# EAGLE design DigitalClockSegmentDisplay_Separator (EAGLE 9.6.1)
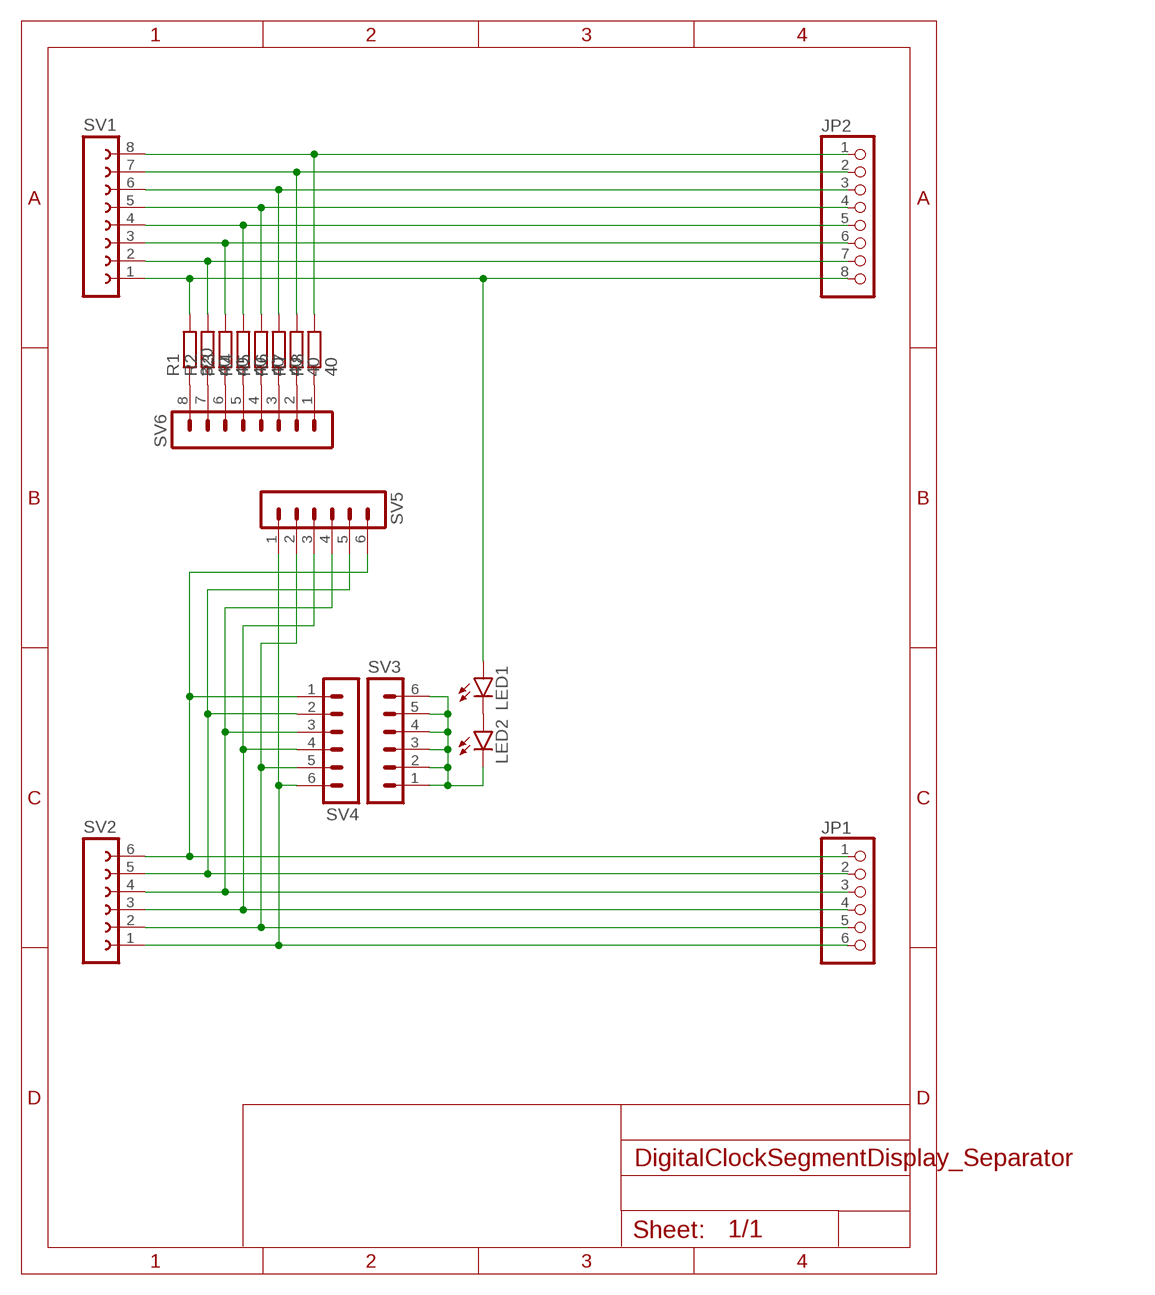
[diagram p0: schematic, sheet 1]

## Parts
JP1  PINHD-1X6/90  [1X06/90]
JP2  PINHD-1X8/90  [1X08/90]
LED1  LED5MM  [LED5MM]
LED2  LED5MM  [LED5MM]
R1  320  R-EU_0207/10  [0207/10]
R2  40  R-EU_0207/10  [0207/10]
R3  40  R-EU_0207/10  [0207/10]
R4  40  R-EU_0207/10  [0207/10]
R5  40  R-EU_0207/10  [0207/10]
R6  40  R-EU_0207/10  [0207/10]
R7  40  R-EU_0207/10  [0207/10]
R8  40  R-EU_0207/10  [0207/10]
SV1  FE08W  [FE08W]
SV2  FE06W  [FE06W]
SV3  MA06-1  [MA06-1]
SV4  MA06-1  [MA06-1]
SV5  MA06-1  [MA06-1]
SV6  MA08-1  [MA08-1]

## Nets
N$1: JP2.1 R8.2 SV1.8
N$2: JP2.2 R7.2 SV1.7
N$3: JP2.3 R6.2 SV1.6
N$4: JP2.4 R5.2 SV1.5
N$5: JP2.5 R4.2 SV1.4
N$6: JP2.6 R3.2 SV1.3
N$7: JP2.7 R2.2 SV1.2
N$8: JP2.8 LED1.A R1.2 SV1.1
N$9: JP1.1 SV2.6 SV4.1 SV5.6
N$10: JP1.2 SV2.5 SV4.2 SV5.5
N$11: JP1.3 SV2.4 SV4.3 SV5.4
N$12: JP1.4 SV2.3 SV4.4 SV5.3
N$13: JP1.5 SV2.2 SV4.5 SV5.2
N$14: JP1.6 SV2.1 SV4.6 SV5.1
N$15: LED2.K(C) SV3.1 SV3.2 SV3.3 SV3.4 SV3.5 SV3.6
N$16: LED1.K(C) LED2.A
N$17: R1.1 SV6.8
N$18: R2.1 SV6.7
N$19: R3.1 SV6.6
N$20: R4.1 SV6.5
N$21: R5.1 SV6.4
N$22: R6.1 SV6.3
N$23: R7.1 SV6.2
N$24: R8.1 SV6.1

## Library data of the parts
JP1 = pinhead:PINHD-1X6: PIN HEADER
JP2 = pinhead:PINHD-1X8: PIN HEADER
LED1 LED2 = led:LED: LED OSRAM: - CHIPLED LG R971, LG N971, LY N971, LG Q971, LY Q971, LO R971, LY R971 LH N974, LH R974 LS Q976, LO Q976, LY Q976 LO Q996 - Hyper CHIPLED LW Q18S LB Q993, LB Q99A, LB R99A - SideLED LS A670, LO A670, LY A670, LG A670, LP A670 LB A673, LV A673, LT A673, LW A673 LH A674 LY A675 LS A676, LA A676, LO A676, LY A676, LW A676 LS A679, LY A679, LG A679 - Hyper Micro SIDELED® LS Y876, LA Y876, LO Y876, LY Y876 LT Y87S - SmartLED LW L88C, LW L88S LB L89C, LB L89S, LG L890 LS L89K, LO L89K, LY L89K LS L896, LA L896, LO L896, LY L896 - TOPLED LS T670, LO T670, LY T670, LG T670, LP T670 LSG T670, LSP T670, LSY T670, LOP T670, LYG T670 LG T671, LOG T671, LSG T671 LB T673, LV T673, LT T673, LW T673 LH T674 LS T676, LA T676, LO T676, LY T676, LB T676, LH T676, LSB T676, LW T676 LB T67C, LV T67C, LT T67C, LS T67K, LO T67K, LY T67K, LW E67C LS E67B, LA E67B, LO E67B, LY E67B, LB E67C, LV E67C, LT E67C LW T67C LS T679, LY T679, LG T679 LS T770, LO T770, LY T770, LG T770, LP T770 LB T773, LV T773, LT T773, LW T773 LH T774 LS E675, LA E675, LY E675, LS T675 LS T776, LA T776, LO T776, LY T776, LB T776 LHGB T686 LT T68C, LB T68C - Hyper Mini TOPLED® LB M676 - Mini TOPLED Santana® LG M470 LS M47K, LO M47K, LY M47K Source: http://www.osram.convergy.de LUXEON: - LUMILED® LXK2-PW12-R00, LXK2-PW12-S00, LXK2-PW14-U00, LXK2-PW14-V00 LXK2-PM12-R00, LXK2-PM12-S00, LXK2-PM14-U00 LXK2-PE12-Q00, LXK2-PE12-R00, LXK2-PE12-S00, LXK2-PE14-T00, LXK2-PE14-U00 LXK2-PB12-K00, LXK2-PB12-L00, LXK2-PB12-M00, LXK2-PB14-N00, LXK2-PB14-P00, LXK2-PB14-Q00 LXK2-PR12-L00, LXK2-PR12-M00, LXK2-PR14-Q00, LXK2-PR14-R00 LXK2-PD12-Q00, LXK2-PD12-R00, LXK2-PD12-S00 LXK2-PH12-R00, LXK2-PH12-S00 LXK2-PL12-P00, LXK2-PL12-Q00, LXK2-PL12-R00 Source: www.luxeon.com KINGBRIGHT: KA-3528ASYC Source: www.kingbright.com
R1-R8 = rcl:R-EU_: RESISTOR, European symbol; SPICEPREFIX: R
SV1 = con-lsta:FE08W: FEMALE HEADER; OC_FARNELL: unknown; OC_NEWARK: unknown
SV2 = con-lsta:FE06W: FEMALE HEADER; OC_FARNELL: unknown; OC_NEWARK: unknown
SV3-SV5 = con-lstb:MA06-1: PIN HEADER; OC_FARNELL: unknown; OC_NEWARK: unknown
SV6 = con-lstb:MA08-1: PIN HEADER; OC_FARNELL: unknown; OC_NEWARK: unknown

## Board
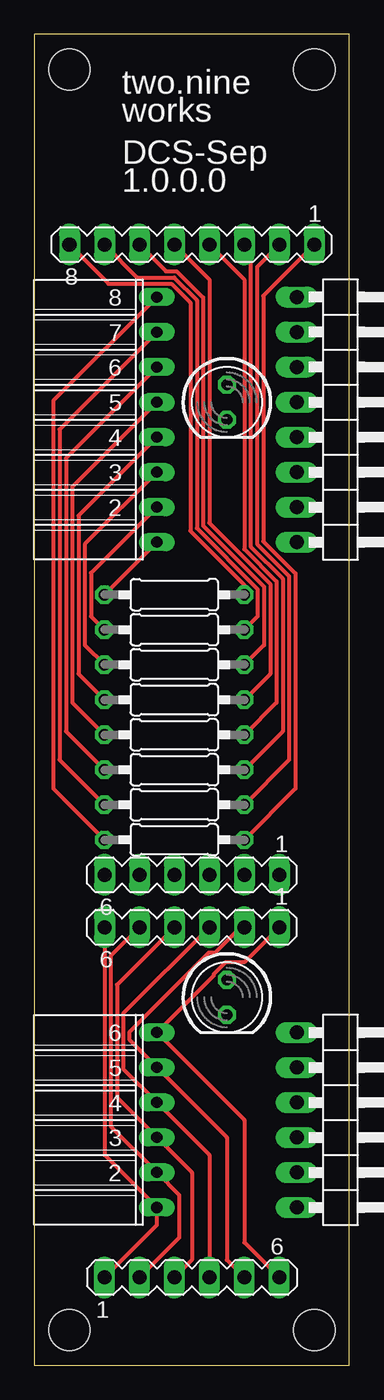
[diagram p1: board, top side]
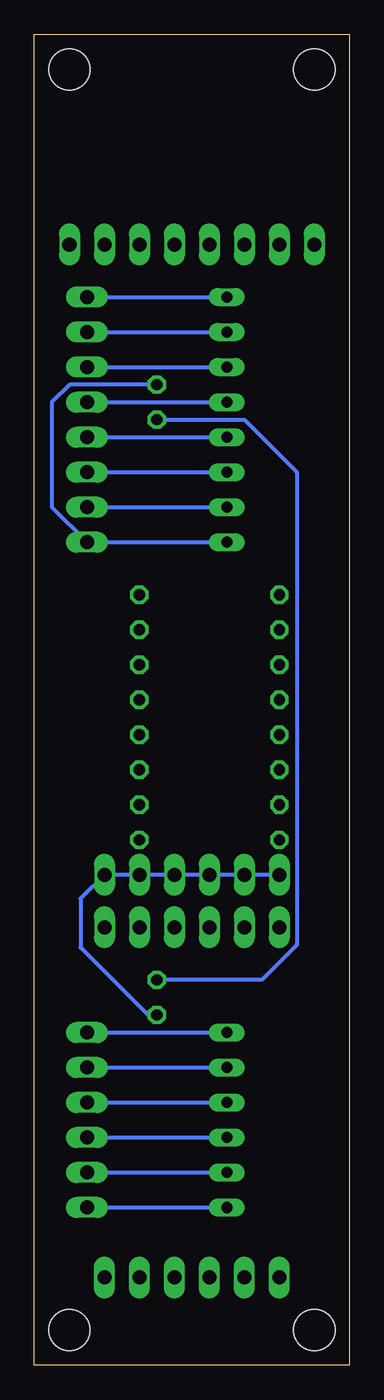
[diagram p2: board, bottom side, seen from below]

Size 22.86 x 96.52 mm. Coordinates in mm from the lower left corner, seen from the top.
Outline: 0,0 22.86,0 22.86,96.52 0,96.52 0,0
Copper layers (1*16): Top 0.035mm / dielectric 1.5mm / Bottom 0.035mm
Design rules "SeeedStudio_2layer_DRU_no_angle_20140221": minimum track width 6mil, minimum drill 12mil, track to track 6mil, track to pad 6mil, pad to pad 6mil, via to via 6mil, smd to smd 0mil, copper to edge 10mil, drill to drill 10mil, minimum pad ring 10mil, minimum via ring 6mil, stop-mask expansion 2mil, vias tented up to drill 100mil, thermal gap 10mil
Holes 3 mm at 2.54,93.98 20.32,93.98 2.54,2.54 20.32,2.54

### Footprints (pad centres in the part's own frame; a part is rotated, then mirrored left to right if it is on the bottom)
1X06/90 = drill 1.016 long: 1 -6.35,-3.81; 2 -3.81,-3.81; 3 -1.27,-3.81; 4 1.27,-3.81; 5 3.81,-3.81; 6 6.35,-3.81
1X08/90 = drill 1.016 long: 1 -8.89,-3.81; 2 -6.35,-3.81; 3 -3.81,-3.81; 4 -1.27,-3.81; 5 1.27,-3.81; 6 3.81,-3.81; 7 6.35,-3.81; 8 8.89,-3.81
LED5MM = drill 0.813 octagon: A -1.27,0; K 1.27,0
0207/10 = drill 0.813 octagon: 1 -5.08,0; 2 5.08,0
FE08W = drill 0.813 long: 1 -8.89,0; 2 -6.35,0; 3 -3.81,0; 4 -1.27,0; 5 1.27,0; 6 3.81,0; 7 6.35,0; 8 8.89,0
FE06W = drill 0.813 long: 1 -6.35,0; 2 -3.81,0; 3 -1.27,0; 4 1.27,0; 5 3.81,0; 6 6.35,0
MA06-1 = drill 1.016 long: 1 -6.35,0; 2 -3.81,0; 3 -1.27,0; 4 1.27,0; 5 3.81,0; 6 6.35,0
MA08-1 = drill 1.016 long: 1 -8.89,0; 2 -6.35,0; 3 -3.81,0; 4 -1.27,0; 5 1.27,0; 6 3.81,0; 7 6.35,0; 8 8.89,0

### Placement (x,y rotation side)
JP1  22.86,17.78 270 top
JP2  22.86,68.58 270 top
LED1  13.97,69.85 270 top
LED2  13.97,26.67 270 top
R1  10.16,55.88 180 top
R2  10.16,53.34 180 top
R3  10.16,50.8 180 top
R4  10.16,48.26 180 top
R5  10.16,45.72 180 top
R6  10.16,43.18 180 top
R7  10.16,40.64 180 top
R8  10.16,38.1 180 top
SV1  8.89,68.58 90 top
SV2  8.89,17.78 90 top
SV3  11.43,35.56 180 top
SV4  11.43,31.75 180 top
SV5  11.43,6.35 0 top
SV6  11.43,81.28 180 top

### Tracks (layer width: path | path; a pad name or v marks a point on that pad's centre or on a via)
N$1
  Top 0.305: SV1.8 1.37,69.95 1.37,41.81 R8.2
  Bottom 0.305: JP2.1 SV1.8
N$2
  Top 0.305: SV1.7 1.83,67.87 1.83,43.89 R7.2
  Bottom 0.305: JP2.2 SV1.7
N$3
  Top 0.305: SV1.6 2.29,65.79 2.29,45.97 R6.2
  Bottom 0.305: JP2.3 SV1.6
N$4
  Top 0.305: SV1.5 2.74,63.7 2.74,48.06 R5.2
  Bottom 0.305: JP2.4 SV1.5
N$5
  Top 0.305: SV1.4 3.2,61.62 3.2,50.14 R4.2
  Bottom 0.305: JP2.5 SV1.4
N$6
  Top 0.305: R3.2 3.66,52.22 3.66,59.54 SV1.3
  Bottom 0.305: JP2.6 SV1.3
N$7
  Top 0.305: R2.2 4.12,54.3 4.12,57.45 SV1.2
  Bottom 0.305: JP2.7 SV1.2
N$8
  Top 0.305: SV1.1 R1.2
  Bottom 0.305: SV1.1 JP2.8 21.59,62.23 21.59,69.85 20.32,71.12 LED1.A
N$9
  Top 0.305: SV5.6 15.24,8.89 15.24,17.78 SV2.6 13.01,28.25 13.01,28.34 13.88,29.21 15.24,29.21 SV4.1
  Bottom 0.305: JP1.1 SV2.6
N$10
  Top 0.305: SV5.5 13.97,7.62 13.97,16.51 SV2.5 6.91,23.57 6.91,24.17 12.66,29.92 13.14,29.92 14.97,31.75 SV4.2
  Bottom 0.305: JP1.2 SV2.5
N$11
  Top 0.305: SV5.4 12.7,15.24 SV2.4 6.45,21.49 6.45,25.5 SV4.3
  Bottom 0.305: JP1.3 SV2.4
N$12
  Top 0.305: SV5.3 11.43,7.62 11.43,13.97 SV2.3 5.99,19.41 5.99,27.58 SV4.4
  Bottom 0.305: JP1.4 SV2.3
N$13
  Top 0.305: SV5.2 10.52,9.25 10.52,12.34 SV2.2 5.54,17.32 5.54,29.67 SV4.5
  Bottom 0.305: JP1.5 SV2.2
N$14
  Top 0.305: SV5.1 8.89,10.16 SV2.1 5.08,15.24 SV4.6
  Bottom 0.305: JP1.6 SV2.1
N$15
  Bottom 0.305: SV3.6 SV3.5 SV3.4 SV3.3 SV3.2 SV3.1 19.51,33.83 19.51,30.29 14.62,25.4 LED2.K
N$16
  Bottom 0.305: LED1.K 7.62,68.58 3.81,64.77 3.81,30.48 6.35,27.94 LED2.A
N$17
  Top 0.305: R1.1 15.24,56.6 11.33,60.51 11.33,77.06 9.95,78.44 5.38,78.44 SV6.8
N$18
  Top 0.305: R2.1 16.2,54.3 16.2,56.28 11.79,60.7 11.79,77.25 10.14,78.89 7.47,78.89 SV6.7
N$19
  Top 0.305: R3.1 16.66,52.22 16.66,56.47 12.24,60.89 12.24,77.44 10.33,79.35 9.55,79.35 SV6.6
N$20
  Top 0.305: R4.1 17.12,50.14 17.12,56.66 12.7,61.08 12.7,78.74 SV6.5
N$21
  Top 0.305: R5.1 17.58,48.06 17.58,56.85 15.24,59.19 15.24,78.74 SV6.4
N$22
  Top 0.305: R6.1 18.03,45.97 18.03,57.04 15.7,59.37 15.7,80.82 SV6.3
N$23
  Top 0.305: R7.1 18.49,43.89 18.49,57.23 16.15,59.56 16.15,79.65 SV6.2
N$24
  Top 0.305: R8.1 18.95,41.81 18.95,57.42 16.61,59.75 16.61,77.57 SV6.1

### Text on the board
tNames: two.nine / works | DCS-Sep / 1.0.0.0